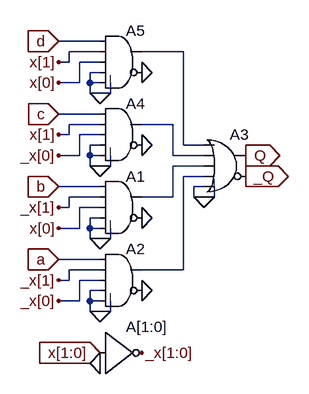
[diagram p0: schematic mux-1bit-4to1.asc]
mux-1bit-4to1.asc, the LTspice schematic file:
Version 4
SHEET 1 880 680
WIRE 144 -160 80 -160
WIRE 144 -144 96 -144
WIRE 272 -144 208 -144
WIRE 96 -128 96 -144
WIRE 96 -128 80 -128
WIRE 144 -128 112 -128
WIRE 144 -112 128 -112
WIRE 112 -96 112 -128
WIRE 112 -96 80 -96
WIRE 128 -96 128 -112
WIRE 144 -96 128 -96
WIRE 128 -80 128 -96
WIRE 144 -80 128 -80
WIRE 160 -80 160 -96
WIRE 160 -80 144 -80
WIRE 144 -48 80 -48
WIRE 144 -32 96 -32
WIRE 256 -32 208 -32
WIRE 96 -16 96 -32
WIRE 96 -16 80 -16
WIRE 144 -16 112 -16
WIRE 144 0 128 0
WIRE 272 0 272 -144
WIRE 304 0 272 0
WIRE 112 16 112 -16
WIRE 112 16 80 16
WIRE 128 16 128 0
WIRE 144 16 128 16
WIRE 256 16 256 -32
WIRE 304 16 256 16
WIRE 128 32 128 16
WIRE 144 32 128 32
WIRE 160 32 160 16
WIRE 160 32 144 32
WIRE 304 32 256 32
WIRE 304 48 272 48
WIRE 144 64 80 64
WIRE 304 64 288 64
WIRE 144 80 96 80
WIRE 256 80 256 32
WIRE 256 80 208 80
WIRE 288 80 288 64
WIRE 304 80 288 80
WIRE 320 80 320 64
WIRE 320 80 304 80
WIRE 96 96 96 80
WIRE 96 96 80 96
WIRE 144 96 112 96
WIRE 144 112 128 112
WIRE 112 128 112 96
WIRE 112 128 80 128
WIRE 128 128 128 112
WIRE 144 128 128 128
WIRE 128 144 128 128
WIRE 144 144 128 144
WIRE 160 144 160 128
WIRE 160 144 144 144
WIRE 144 176 80 176
WIRE 144 192 96 192
WIRE 272 192 272 48
WIRE 272 192 208 192
WIRE 96 208 96 192
WIRE 96 208 80 208
WIRE 144 208 112 208
WIRE 144 224 128 224
WIRE 112 240 112 208
WIRE 112 240 80 240
WIRE 128 240 128 224
WIRE 144 240 128 240
WIRE 128 256 128 240
WIRE 144 256 128 256
WIRE 160 256 160 240
WIRE 160 256 144 256
FLAG 144 144 0
FLAG 208 112 0
FLAG 80 64 b
IOPIN 80 64 In
FLAG 144 320 x[1:0]
IOPIN 144 320 In
FLAG 144 256 0
FLAG 208 224 0
FLAG 80 176 a
IOPIN 80 176 In
FLAG 304 80 0
FLAG 368 48 _Q
IOPIN 368 48 Out
FLAG 368 16 Q
IOPIN 368 16 Out
FLAG 144 336 0
FLAG 208 320 _x[1:0]
FLAG 80 208 _x[1]
FLAG 80 240 _x[0]
FLAG 80 96 _x[1]
FLAG 80 128 x[0]
FLAG 144 32 0
FLAG 208 0 0
FLAG 80 -48 c
IOPIN 80 -48 In
FLAG 80 -16 x[1]
FLAG 80 16 _x[0]
FLAG 144 -80 0
FLAG 208 -112 0
FLAG 80 -160 d
IOPIN 80 -160 In
FLAG 80 -128 x[1]
FLAG 80 -96 x[0]
SYMBOL Digital\\and 176 32 R0
SYMATTR InstName A1
SYMBOL Digital\\or 336 -32 R0
SYMATTR InstName A3
SYMBOL Digital\\inv 144 256 R0
SYMATTR InstName A[1:0]
SYMBOL Digital\\and 176 144 R0
SYMATTR InstName A2
SYMBOL Digital\\and 176 -80 R0
SYMATTR InstName A4
SYMBOL Digital\\and 176 -192 R0
SYMATTR InstName A5

The netlist it stands for:
* mux-1bit-4to1.asc
A1 b _x[1] x[0] 0 0 0 N003 0 AND
A3 N001 N002 N003 N004 0 _Q Q 0 OR
A[1:0] x[1:0] 0 0 0 0 _x[1:0] 0 0 BUF
A2 a _x[1] _x[0] 0 0 0 N004 0 AND
A4 c x[1] _x[0] 0 0 0 N002 0 AND
A5 d x[1] x[0] 0 0 0 N001 0 AND
.backanno
.end